# Altium schematic sheet Sheet1.SCHDOC
size 297 x 209 mm; SheetNumber: 1; SheetTotal: 1; DocumentName: Sheet1.SCHDOC
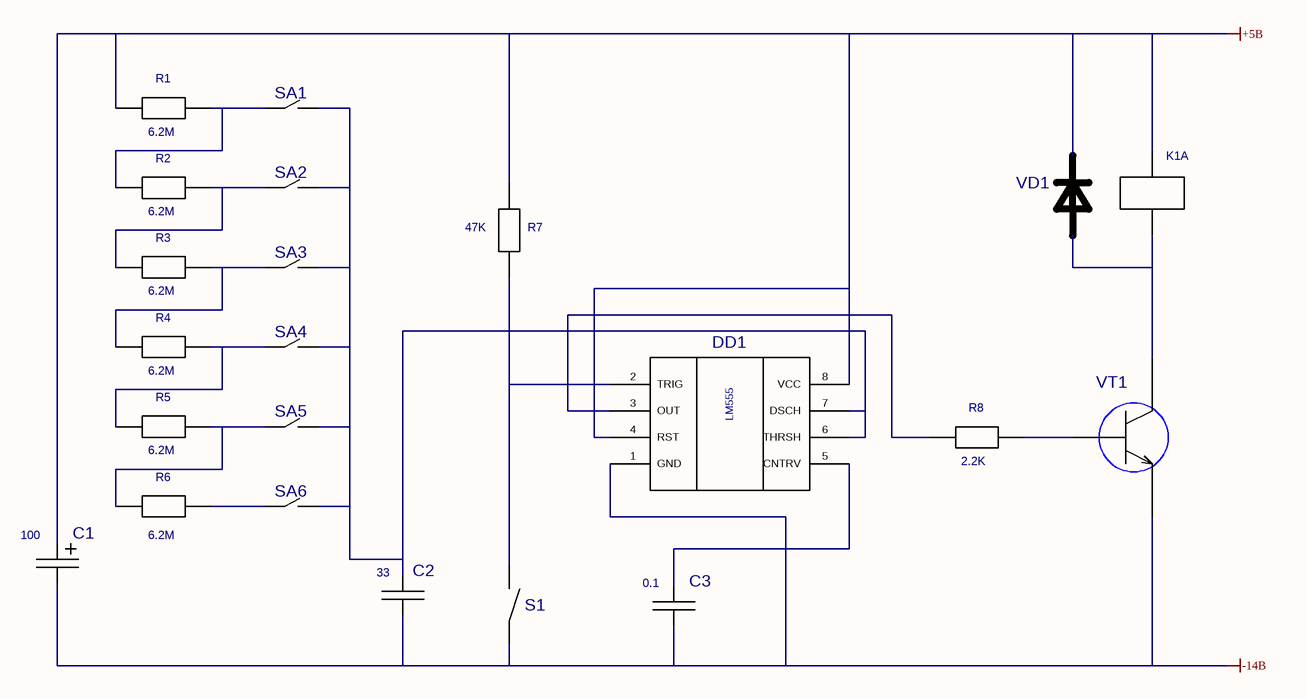
[diagram p0: Sheet1.SCHDOC]

## Parts
C1  value 100  [K534A-1]  (hidden comment: K534A-1)
C2  value 33  [K1047-5]  (hidden comment: K1047-5)
C3  value 0.1  [K1047-5]  (hidden comment: K1047-5)
DD1  LM555CM  [SO-8]  (value not drawn)
K1  40.52  [К40.52]  (value not drawn)  (part A of 3)
R1  value 6.2M  [R100]  (hidden comment: R100)
R2  value 6.2M  [R100]  (hidden comment: R100)
R3  value 6.2M  [R100]  (hidden comment: R100)
R4  value 6.2M  [R100]  (hidden comment: R100)
R5  value 6.2M  [R100]  (hidden comment: R100)
R6  value 6.2M  [R100]  (hidden comment: R100)
R7  value 47K  [R100]  (hidden comment: R100)
R8  value 2.2K  [R100]  (hidden comment: R100)
S1  PKN159-1  [PKN159-1]  (value not drawn)
SA1  8AS9M2RE  [8AS9M2RE]  (value not drawn)
SA2  8AS9M2RE  [8AS9M2RE]  (value not drawn)
SA3  8AS9M2RE  [8AS9M2RE]  (value not drawn)
SA4  8AS9M2RE  [8AS9M2RE]  (value not drawn)
SA5  8AS9M2RE  [8AS9M2RE]  (value not drawn)
SA6  8AS9M2RE  [8AS9M2RE]  (value not drawn)
VD1  КД522А  [КД521(522)]  (value not drawn)
VT1  КТ315В  [KT13]  (value not drawn)

## Nets
+5B: C1.1(I/OA) DD1.4(RST) DD1.8(VCC) K1.A1 R1.1 R7.2 VD1.2(K)
-14B: C1.2(I/OB) C2.2(I/OB) C3.2(I/OB) DD1.1(GND) S1.1(I/O1) VT1.1(E)
NetC2_1: C2.1(I/OA) DD1.6(THRSH) DD1.7(DSCH) SA1.1 SA2.1 SA3.1 SA4.1 SA5.1 SA6.1
NetC3_1: C3.1(I/OA) DD1.5(CNTRV)
NetDD1_2: DD1.2(TRIG) R7.1 S1.2(I/O2)
NetDD1_3: DD1.3(OUT) R8.1
NetK1_A2: K1.A2 VD1.1(A) VT1.3(K)
NetR1_2: R1.2 R2.1 SA1.2
NetR2_2: R2.2 R3.1 SA2.2
NetR3_2: R3.2 R4.1 SA3.2
NetR4_2: R4.2 R5.1 SA4.2
NetR5_2: R5.2 R6.1 SA5.2
NetR6_2: R6.2 SA6.2
NetR8_2: R8.2 VT1.2(B)

## Notes on the sheet
- (in symbol LM555CM) LM555

## Library data of the parts
C1 = K534A-1: PDIF_TY: 11245
C2 C3 = K1047-5: PDIF_TY: 11213
DD1 = LM555CM: Value: *
K1 = 40.52: Value: *; Author: pcbdesigner.ru
S1 = PKN159-1: Value: *
SA1-SA6 = 8AS9M2RE: Value: *; Author: pcbdesigner.ru
VD1 = КД522А: Value: *
VT1 = КТ315В: Value: *